# Altium schematic sheet Energy_harvesting.SchDoc: Triumvi - Sensing - Energy Harvesting
size Letter; Author: Ye-Sheng Kuo; Revision: 10; SheetNumber: 2; SheetTotal: 6
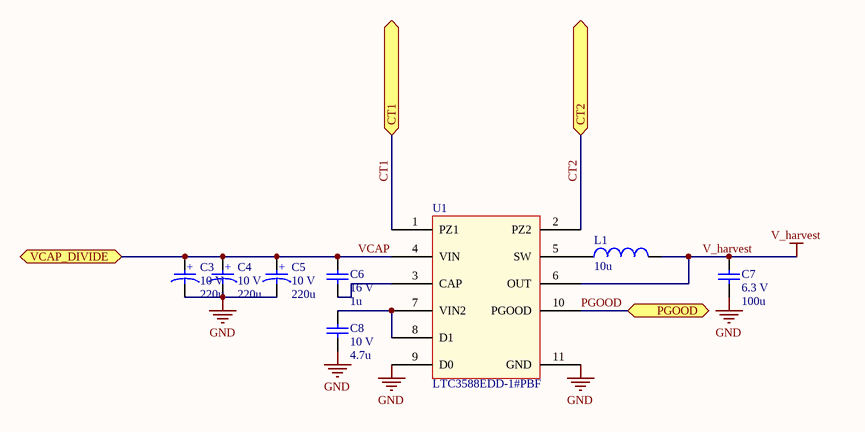
[diagram p0: Energy_harvesting.SchDoc]

## Parts
C3  voltage rated: 10 V  [2312]  (hidden comment: 220u)
C4  voltage rated: 10 V  [2312]  (hidden comment: 220u)
C5  voltage rated: 10 V  [2312]  (hidden comment: 220u)
C6  voltage rated: 16 V  [0402]  (hidden comment: 1u)
C7  voltage rated: 6.3 V  [1206]  (hidden comment: 100u)
C8  voltage rated: 10 V  [0603]  (hidden comment: 4.7u)
L1  10u  [CDRH2D18]
U1  LTC3588EDD-1#PBF  [QFN-10]

## Ports
CT1, CT2, PGOOD, VCAP_DIVIDE

## Nets
GND: C3.2 C4.2 C5.2 C7.2 C8.2 U1.9(D0) U1.11(GND)
V_harvest: C7.1 L1.1 U1.6(OUT)
CT1: U1.1(PZ1) ; port CT1
CT2: U1.2(PZ2) ; port CT2
PGOOD: U1.10(PGOOD) ; port PGOOD
VCAP: C3.1 C4.1 C5.1 C6.1 U1.4(VIN) ; port VCAP_DIVIDE
NetC6_2: C6.2 U1.3(CAP)
NetC8_1: C8.1 U1.7(VIN2) U1.8(D1)
NetL1_2: L1.2 U1.5(SW)

## Notes on the sheet
- Title
- Date:
- Author:
- Revision:
- Sheet
- of
- University of Michigan
- File:
- (in symbol TAJC227K010RNJ) +

## Library data of the parts
C3-C5 = TAJC227K010RNJ: 220µF ±10% Molded Tantalum Capacitors 10V 2312; Manufacture: AVX; ESR: 500m Ohm; tolerance: 10%; package: 2312; Supplier 1: Digi-Key; Supplier Part Number 1: 478-4774-1-ND; Value: 220u; Manufacturer Part Number: TAJC227K010RNJ
C6 = C1005X6S1C105K050BC: 1µF ±10% 16V Ceramic Capacitor X6S 0402; Manufacture: TDK; tolerance: 10%; package: 0402; Supplier 1: Digi-Key; Supplier Part Number 1: 445-9086-1-ND; Value: 1u; Temperature Coefficient: X6S; Manufacturer Part Number: C1005X6S1C105K050BC
C7 = GRM31CR60J107ME39K: 100µF ±20% 6.3V Ceramic Capacitor X5R 1206; Manufacture: Kemet; tolerance: 20%; package: 1206; Supplier 1: Digi-Key; Supplier Part Number 1: 490-7217-1-ND; Value: 100u; Temperature Coefficient: X5R; Manufacturer Part Number: GRM31CR60J107ME39K
C8 = CGB3B1X5R1A475K055AC: 4.7µF ±10% 10V Ceramic Capacitor X5R 0603; Manufacture: TDK; tolerance: 10%; package: 0603; Supplier 1: Digi-Key; Supplier Part Number 1: 445-7482-1-ND; Value: 4.7u; Temperature Coefficient: X5R; Manufacturer Part Number: CGB3B1X5R1A475K055AC
L1 = CDRH2D18/LDNP-100NC: 10µH Shielded Inductor 1A 180 mOhm Max Nonstandard; Manufacturer: Sumida; tolerance: 30%; DCR (Max): 180m; Supplier 1: Digi-Key; Supplier Part Number 1: 308-1959-1-ND; Value: 10u; Current Rating: 1 A; Manufacturer Part Number: CDRH2D18/LDNP-100NC
U1 = LTC3588EDD-1#PBF: Piezoelectric Energy Harvesting Power Supply; Supplier 1: Digi-Key; Supplier Part Number 1: LTC3588EDD-1#PBF-ND